# Altium schematic sheet TPS54560_5V_and_12V_regulated_output.SchDoc
size A4; SheetNumber: 2; SheetTotal: 4
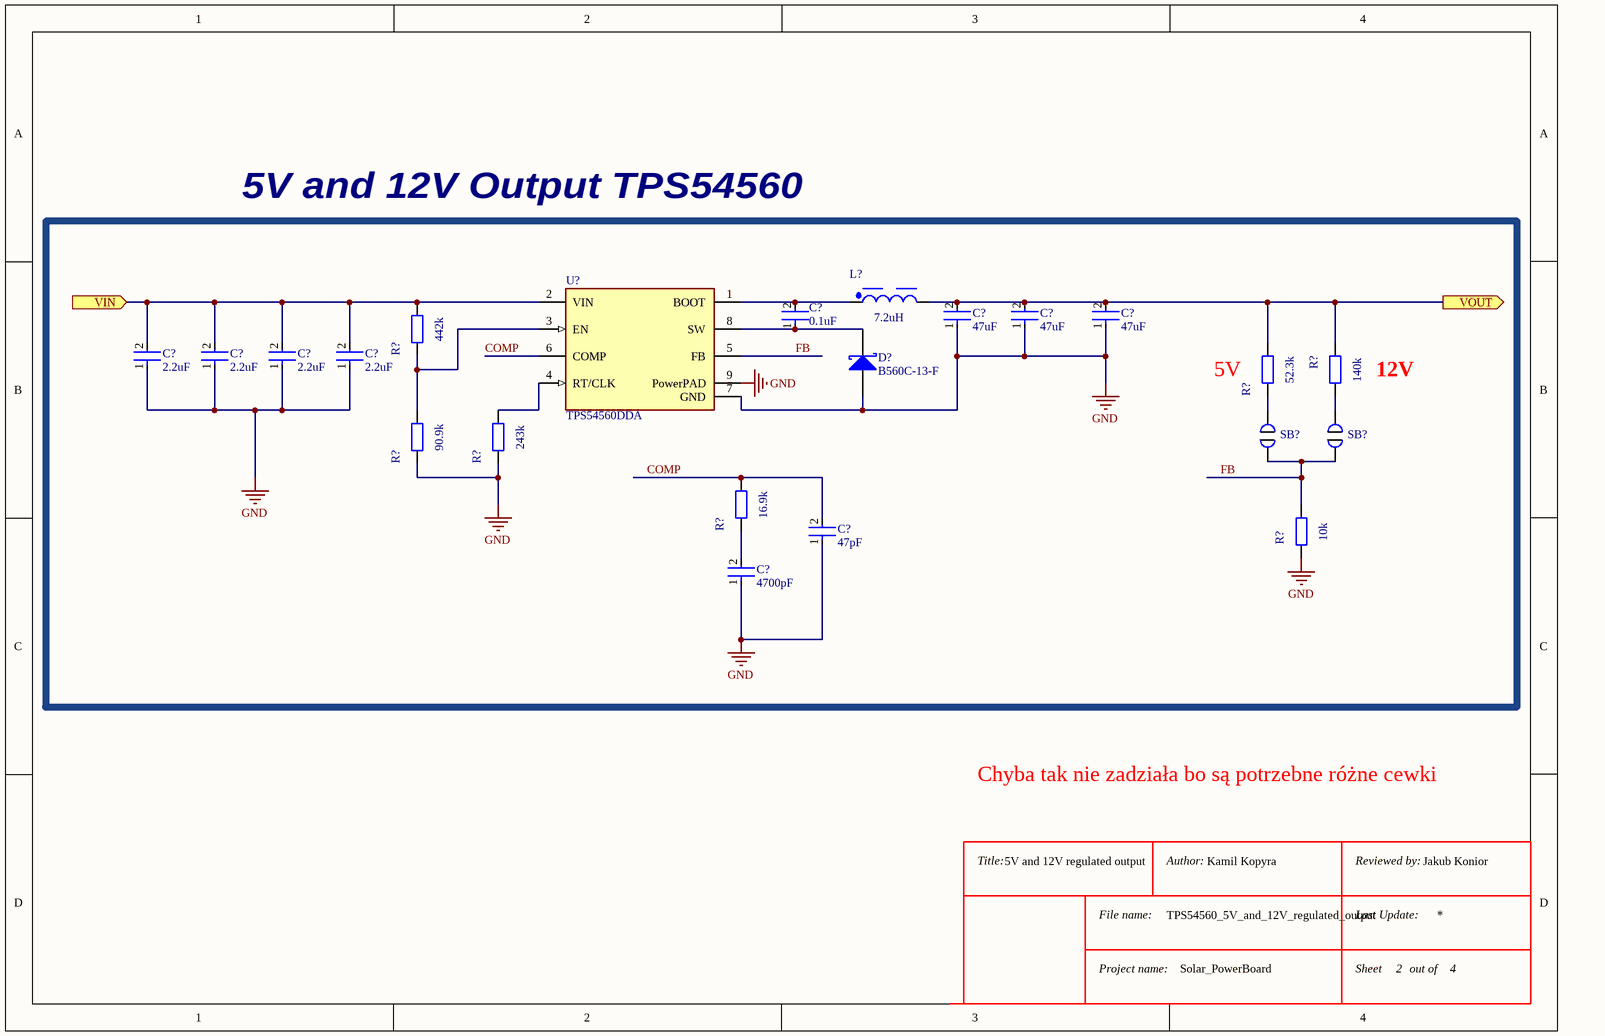
[diagram p0: TPS54560_5V_and_12V_regulated_output.SchDoc]

## Parts
(Parts that share a designator on the sheet are numbered #1, #2 ... from top to bottom, then left to right.)
C?#1  0.1uF  [FP-GRM21B-0_2-e0_2_0_7-IPC_B]
C?#2  47uF  [FP-GRM21B-0_2-e0_2_0_7-IPC_B]
C?#3  47uF  [FP-GRM21B-0_2-e0_2_0_7-IPC_B]
C?#4  47uF  [FP-GRM21B-0_2-e0_2_0_7-IPC_B]
C?#5  2.2uF  [FP-GRM21B-0_2-e0_2_0_7-IPC_B]
C?#6  2.2uF  [FP-GRM21B-0_2-e0_2_0_7-IPC_B]
C?#7  2.2uF  [FP-GRM21B-0_2-e0_2_0_7-IPC_B]
C?#8  2.2uF  [FP-GRM21B-0_2-e0_2_0_7-IPC_B]
C?#9  47pF  [FP-GRM21B-0_2-e0_2_0_7-IPC_B]
C?#10  4700pF  [FP-GRM21B-0_2-e0_2_0_7-IPC_B]
D?  B560C-13-F  [DIOD-B5X0C-2_M]
L?  7.2uH  [WE-TI_8095]
R?#1  442k  [WRIS-RSKS_0402]
R?#2  52.3k  [WRIS-RSKS_0402]
R?#3  140k  [WRIS-RSKS_0402]
R?#4  90.9k  [WRIS-RSKS_0402]
R?#5  243k  [WRIS-RSKS_0402]
R?#6  16.9k  [WRIS-RSKS_0402]
R?#7  10k  [WRIS-RSKS_0402]
SB?#1  Solder Bridge  (value not drawn)
SB?#2  Solder Bridge  (value not drawn)
U?  TPS54560DDA  [FP-DDA0008E-MFG]

## Ports
VIN (in), VOUT (out)

## Nets
GND: C?#2.1 C?#3.1 C?#4.1 C?#5.1 C?#6.1 C?#7.1 C?#8.1 C?#9.1 C?#10.1 D?.2(A) R?#4.1 R?#5.1 R?#7.1 U?.7(GND) U?.9(PowerPAD)
COMP: C?#9.2 R?#6.2 U?.6(COMP)
FB: R?#7.2 SB?#1.1 SB?#2.1 U?.5(FB)
VIN: C?#5.2 C?#6.2 C?#7.2 C?#8.2 R?#1.2 U?.2(VIN) ; port VIN
VOUT: C?#2.2 C?#3.2 C?#4.2 L?.2 R?#2.2 R?#3.2 ; port VOUT
NetC?#1_1: C?#1.1 D?.1(K) U?.8(SW)
NetC?#1_2: C?#1.2 L?.1 U?.1(BOOT)
NetC?#10_2: C?#10.2 R?#6.1
NetR?#1_1: R?#1.1 R?#4.2 U?.3(EN)
NetR?#2_1: R?#2.1 SB?#1.2
NetR?#3_1: R?#3.1 SB?#2.2
NetR?#5_2: R?#5.2 U?.4(RT/CLK)

## Notes on the sheet
- 5V and 12V Output TPS54560
- 5V
- 12V
- Chyba tak nie zadziała bo są potrzebne różne cewki
- 5V and 12V regulated output
- Kamil Kopyra
- Jakub Konior
- TPS54560_5V_and_12V_regulated_output
- Solar_PowerBoard
- Title:
- File name:
- Author:
- Reviewed by:
- Last Update:
- Project name:
- Sheet
- out of

## Library data of the parts
C?#1-C?#10 = CMP-06035-063309-1: CAP CER 2.2UF 100V X7T 0805
D? = CMP-2000-05098-2: Schottky Barrier Rectifier, 5 A, 60 V, -55 to 125 degC, 2-Pin SMD, RoHS, Tape and Reel; Ir - Reverse Current: 500uA; Configuration: Single; Ifsm - Forward Surge Current: 100A; Vrrm - Repetitive Reverse Voltage: 60V; Brand: DiodesIncorporated; Vf - Forward Voltage: 0.7V; If - Forward Current: 5A; Unit Weight: 0.007408oz; Type: SchottkyBarrierRectifier; Package / Case: SMC; Manufacturer URL: http://www.diodes.com/; Datasheet URL: https://datasheet.ciiva.com/27052/1538961-27052355.pdf; Factory Pack Quantity: 3000; Height: 2.5mm; Width: 6.22mm; Product Category: SchottkyDiodes&Rectifiers; Minimum Operating Temperature: -55C; Manufacturer: DiodesIncorporated; Datasheet Version: Rev. 7-2, 06/2007; Product: SchottkyDiodes; Maximum Operating Temperature: +125C; Operating Temperature Range: -55Cto+125C; Technology: Si; Length: 7.11mm; RoHS: True; Packaging: Reel; Termination Style: SMD/SMT; Series: B560; Mounting Style: SMD/SMT
L? = CMP-03913-110288128-3: Inductor, 22Uh, Unshielded, 3A, Rad Rohs Compliant: Yes; Inductance: 22µH; Voltage Rating: 80V; DC Resistance (DCR): 46mΩ; Ambient Temperature Range High: 85°C; Ambient Temperature Range Low: -40°C; Current Rating: 3A; RoHS: Compliant; Max Operating Temperature: 125°C; Min Operating Temperature: -40°C; Length: 7.8mm; Width: 7.8mm; Height: 9.5mm
R?#1-R?#7 = CMP-03913-145532926-1: Res, 442K, 1%, 0.1W, Thick Film, 0402 Rohs Compliant: Yes
U? = CMP-04918-000033-1: IC REG BCK SPLIT RAIL ADJ 8SOPWR; Manufacturer: Texas Instruments; Min Supply Voltage: 4.5V; Switching Topology: Buck; Max Junction Temp: +150°C; Max Duty Cycle: 100%; Standoff Height: 0mm; Output Type: AdjustableProgrammable; Output Voltage: 0.8-58.8V; Output Current: 5A; Number Of Outputs: 1; Switching Frequency: 100-2500kHz; Max Supply Voltage: 60V; Nominal Supply Current: 146uA; Octopart: https://octopart.com/tps54560dda-texas+instruments-26977150; Temperature: -40°C to +125°C; ComponentLink2Description: Datasheet; Category: IC; Mouser Description: Voltage Regulators - Switching Regulators 60V Input 5 A SD DC-DC Cnvtr; Automotive: No; Ipc Land Pattern Name: SOIC127P600X170-8; Height: 1.7mm; RoHS: TRUE; ComponentLink2URL: http://www.ti.com/lit/ds/symlink/tps54560.pdf; Device Class L3: Voltage Regulators - Switching; Temperature Range High: +125°C; Device Class L2: Power Management ICs; Package: DDA0008E; Lead Free: Yes; Digikey Description: IC REG BCK SPLIT RAIL ADJ 8SOPWR; Device Class L1: Integrated Circuits (ICs); Manufacturer Part Number: TPS54560DDA; Temperature Range Low: -40°C